# Altium schematic sheet Connectors.SchDoc: Connector
size A3; Organization: Hofmann Travel; SheetNumber: 3; SheetTotal: 10
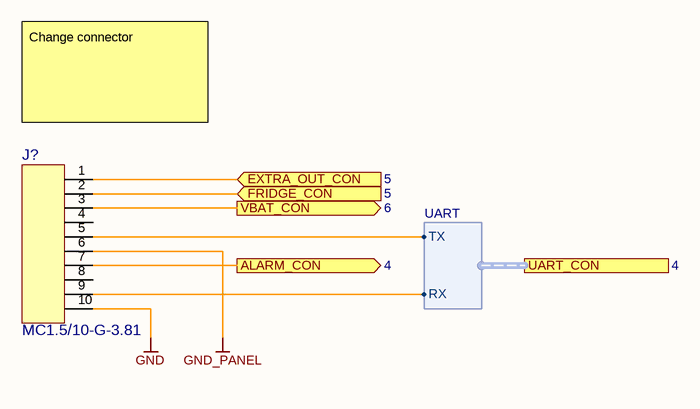
[diagram p0: Connectors.SchDoc]

## Parts
J?  MC1.5/10-G-3.81  [MC1.5/10-G-3.81]

## Ports
ALARM_CON (out, see 4), EXTRA_OUT_CON (in, see 5), FRIDGE_CON (in, see 5), UART_CON (harness UART, see 4), VBAT_CON (out, see 6)

## Harnesses
UART: TX, RX

## Nets
GND: J?.10
GND_PANEL: J?.6
ALARM_CON: J?.7 ; port ALARM_CON
EXTRA_OUT_CON: J?.1 ; port EXTRA_OUT_CON
FRIDGE_CON: J?.2 ; port FRIDGE_CON
VBAT_CON: J?.3 ; port VBAT_CON
NetJ?_5: J?.5 ; port UART_CON.TX
NetJ?_9: J?.9 ; port UART_CON.RX

Not connected (* = marked no-connect by the designer): J? 4 8

## Notes on the sheet
- Change connector
- Date:
- Size:
- A3
- Schema:
- Layout:

## Library data of the parts
J? = MC1.5/10-G-3.81: Phoenix contact MC 1,5/ 10-G-3,81; Manufacturer Part Number 1: 1803358; Part Number: MC1.5/10-G-3.81; Manufacturer: Phoenix; HelpURL: https://www.phoenixcontact.com/en-us/products/pcb-header-mc-1510-g-381-1803358?type=pdf; Manufacturer 1: Phoenix; Supplier 1: Digi-Key; Supplier Part Number 1: 277-1214-ND